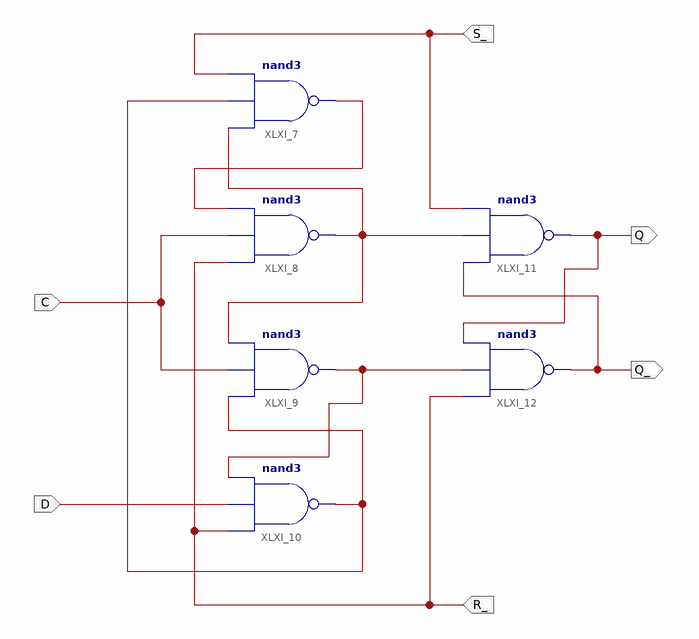
[diagram p0: schematic sheet 1]
// Xilinx ISE schematic D_Flipflop.sch (kintex7) as structural Verilog: 6 symbols, 6 ports
module D_Flipflop (
  input  C,
  input  R_,
  input  S_,
  input  D,
  output Q,
  output Q_
);

  wire XLXN_22, XLXN_23, XLXN_27, XLXN_31;

  nand XLXI_7 (XLXN_22, XLXN_23, XLXN_27, S_);
  nand XLXI_8 (XLXN_23, R_, C, XLXN_22);
  nand XLXI_10 (XLXN_27, R_, D, XLXN_31);
  nand XLXI_9 (XLXN_31, XLXN_27, C, XLXN_23);
  nand XLXI_11 (Q, Q_, XLXN_23, S_);
  nand XLXI_12 (Q_, R_, XLXN_31, Q);
endmodule
